# EAGLE design jam2 (EAGLE 9.6.2)
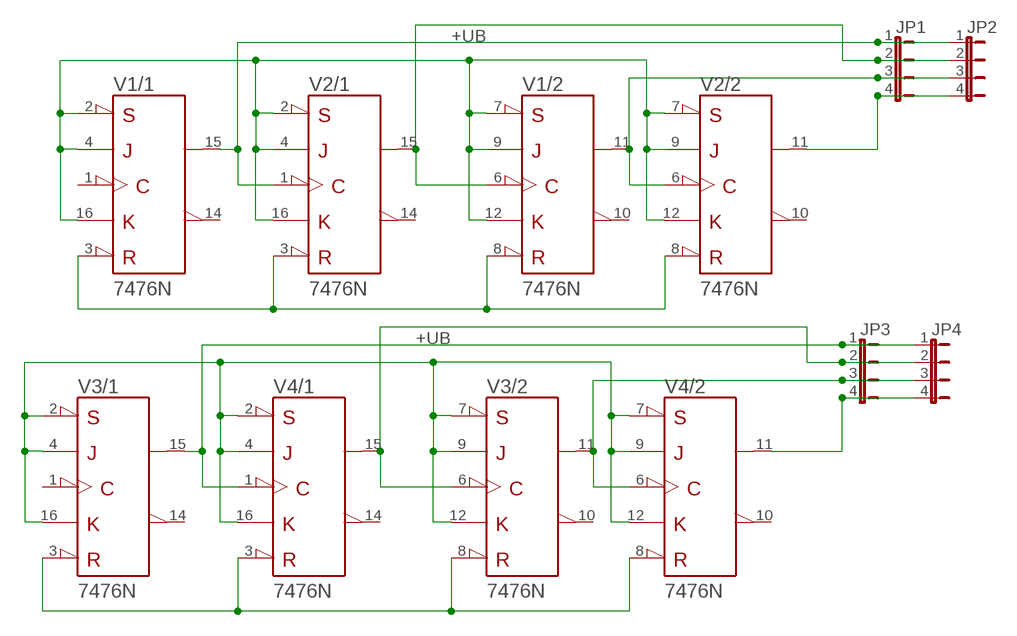
[diagram p0: schematic, sheet 1]

## Parts
JP1  JP4E  [JP4]
JP2  JP4E  [JP4]
JP3  JP4E  [JP4]
JP4  JP4E  [JP4]
V1  7476N  [DIL16]
V2  7476N  [DIL16]
V3  7476N  [DIL16]
V4  7476N  [DIL16]

## Nets
+UB: V1.2(/1:!PRE) V1.4(/1:J) V1.7(/2:!PRE) V1.9(/2:J) V1.12(/2:K) V1.16(/1:K) V2.2(/1:!PRE) V2.4(/1:J) V2.7(/2:!PRE) V2.9(/2:J) V2.12(/2:K) V2.16(/1:K) V3.2(/1:!PRE) V3.4(/1:J) V3.7(/2:!PRE) V3.9(/2:J) V3.12(/2:K) V3.16(/1:K) V4.2(/1:!PRE) V4.4(/1:J) V4.7(/2:!PRE) V4.9(/2:J) V4.12(/2:K) V4.16(/1:K)
N$1: JP1.4 JP2.4 V2.11(/2:Q)
N$2: JP1.3 JP2.3 V1.11(/2:Q) V2.6(/2:CLK)
N$3: JP1.2 JP2.2 V1.6(/2:CLK) V2.15(/1:Q)
N$4: V3.3(/1:!CLR) V3.8(/2:!CLR) V4.3(/1:!CLR) V4.8(/2:!CLR)
N$5: JP3.3 JP4.3 V3.11(/2:Q) V4.6(/2:CLK)
N$6: JP1.1 JP2.1 V1.15(/1:Q) V2.1(/1:CLK)
N$7: JP3.2 JP4.2 V3.6(/2:CLK) V4.15(/1:Q)
N$8: V1.3(/1:!CLR) V1.8(/2:!CLR) V2.3(/1:!CLR) V2.8(/2:!CLR)
N$9: JP3.4 JP4.4 V4.11(/2:Q)
N$10: JP3.1 JP4.1 V3.15(/1:Q) V4.1(/1:CLK)
Unconnected: V1.1(/1:CLK) V1.10(/2:!Q) V1.14(/1:!Q) V2.10(/2:!Q) V2.14(/1:!Q) V3.1(/1:CLK) V3.10(/2:!Q) V3.14(/1:!Q) V4.10(/2:!Q) V4.14(/1:!Q)

## Power pins joined to a net without a drawn wire
+UB: V1.5(/+UB:+UB) V2.5(/+UB:+UB) V3.5(/+UB:+UB) V4.5(/+UB:+UB)
-UB: V1.13(/-UB:-UB) V2.13(/-UB:-UB) V3.13(/-UB:-UB) V4.13(/-UB:-UB)

## Library data of the parts
JP1-JP4 = jumper:JP4E: JUMPER
V1-V4 = 74ttl-din:74*76: Dual J-K FLIP FLOP, preset and clear

## Board
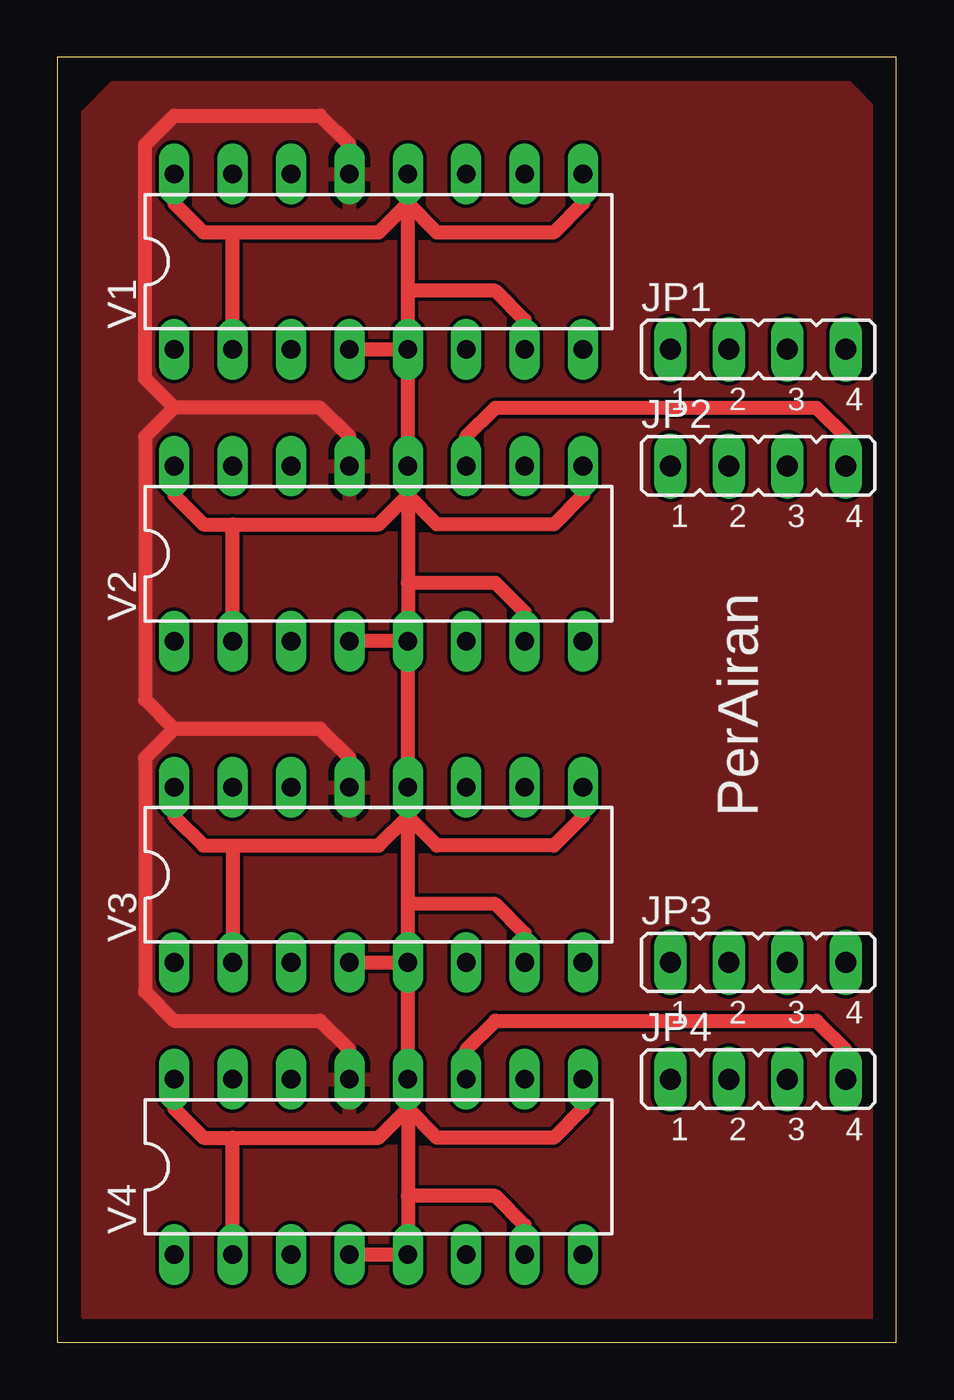
[diagram p1: board, top side]
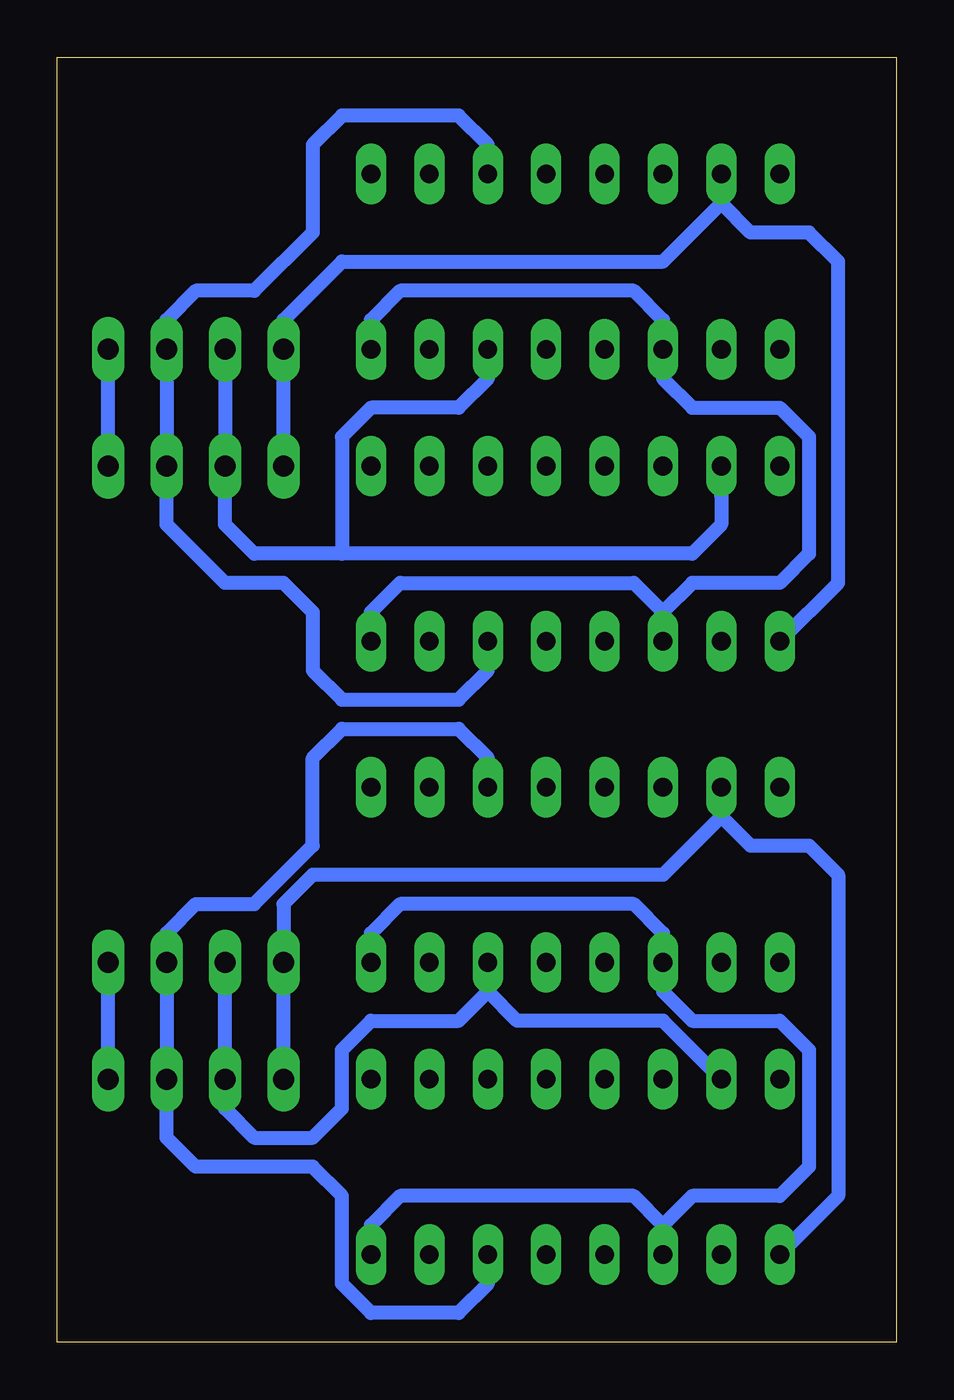
[diagram p2: board, bottom side, seen from below]

Size 36.5 x 55.87 mm. Coordinates in mm from the lower left corner, seen from the top.
Outline: 0,0 36.5,0 36.5,55.87 0,55.87 0,0
Copper layers (1*16): Top 0.035mm / dielectric 1.5mm / Bottom 0.035mm
Design rules "default": minimum track width 6mil, minimum drill 0.35mm, track to track 6mil, track to pad 6mil, pad to pad 6mil, via to via 6mil, smd to smd 6mil, copper to edge 40mil, drill to drill 6mil, minimum pad ring 10mil, minimum via ring 8mil, stop-mask expansion 4mil, vias tented up to drill 0mil, thermal gap 10mil

### Footprints (pad centres in the part's own frame; a part is rotated, then mirrored left to right if it is on the bottom)
JP4 = drill 0.914 long: 1 -3.81,0; 2 -1.27,0; 3 1.27,0; 4 3.81,0
DIL16 = drill 0.813 long: 1 -8.89,-3.81; 2 -6.35,-3.81; 3 -3.81,-3.81; 4 -1.27,-3.81; 5 1.27,-3.81; 6 3.81,-3.81; 7 6.35,-3.81; 8 8.89,-3.81; 9 8.89,3.81; 10 6.35,3.81; 11 3.81,3.81; 12 1.27,3.81; 13 -1.27,3.81; 14 -3.81,3.81; 15 -6.35,3.81; 16 -8.89,3.81

### Placement (x,y rotation side)
JP1  30.48,43.18 0 top
JP2  30.48,38.1 0 top
JP3  30.48,16.51 0 top
JP4  30.48,11.43 0 top
V1  13.97,46.99 0 top
V2  13.97,34.29 0 top
V3  13.97,20.32 0 top
V4  13.97,7.62 0 top

### Tracks (layer width: path | path; a pad name or v marks a point on that pad's centre or on a via)
+UB
  Top 0.61: V1.4 V1.5 | V1.9 22.86,49.53 21.59,48.26 16.51,48.26 15.24,49.53 | V1.12 15.24,49.53 | 15.24,49.53 13.97,48.26 7.62,48.26 | 7.62,48.26 6.35,48.26 5.08,49.53 V1.16 | V1.2 7.62,48.26 | V1.5 15.24,45.72 | 15.24,45.72 15.24,49.53 | V2.16 5.08,36.83 6.35,35.56 7.62,35.56 | 7.62,35.56 13.97,35.56 15.24,36.83 | 15.24,36.83 15.24,33.02 | 15.24,33.02 V2.5 | V2.9 22.86,36.83 21.59,35.56 16.51,35.56 15.24,36.83 | 15.24,36.83 V2.12 V1.5 | V2.2 7.62,35.56 | V2.5 V2.4 | V1.7 20.32,44.45 19.05,45.72 15.24,45.72 | V2.7 20.32,31.75 19.05,33.02 15.24,33.02 | V3.16 5.08,22.86 6.35,21.59 7.62,21.59 | 7.62,21.59 V3.2 | 7.62,21.59 13.97,21.59 15.24,22.86 | 15.24,22.86 V3.12 V2.5 | V3.5 15.24,19.05 | 15.24,19.05 15.24,22.86 | V3.9 22.86,22.86 21.59,21.59 16.51,21.59 15.24,22.86 | V3.4 V3.5 | V3.7 20.32,17.78 19.05,19.05 15.24,19.05 | V4.9 22.86,10.16 21.59,8.89 16.51,8.89 15.24,10.16 | V4.12 15.24,6.35 | 15.24,6.35 V4.5 V4.4 | V4.7 20.32,5.08 19.05,6.35 15.24,6.35 | V4.16 5.08,10.16 6.35,8.89 7.62,8.89 | 7.62,8.89 13.97,8.89 15.24,10.16 | 15.24,10.16 V4.12 | V4.2 7.62,8.89 | V4.12 V3.5
-UB
  Top 0.61: V2.13 12.7,39.37 11.43,40.64 5.08,40.64 | 5.08,40.64 3.81,41.91 3.81,52.07 5.08,53.34 11.43,53.34 12.7,52.07 V1.13 | V4.13 12.7,12.7 11.43,13.97 5.08,13.97 3.81,15.24 3.81,25.4 5.08,26.67 | V3.13 12.7,25.4 11.43,26.67 5.08,26.67 | 5.08,40.64 3.81,39.37 3.81,27.94 5.08,26.67
  pour Top: 2.54,54.61 34.29,54.61 35.56,53.34 35.56,1.27 34.29,0 2.54,0 1.27,1.27 1.27,53.34
N$1
  Top 0.61: V2.11 17.78,39.37 19.05,40.64 33.02,40.64 34.29,39.37 JP2.4
  Bottom 0.61: JP2.4 JP1.4
N$2
  Bottom 0.61: V2.6 17.78,29.21 19.05,27.94 24.13,27.94 25.4,29.21 25.4,31.75 26.67,33.02 29.21,33.02 31.75,35.56 JP2.3 JP1.3 31.75,44.45 30.48,45.72 27.94,45.72 25.4,48.26 25.4,52.07 24.13,53.34 19.05,53.34 17.78,52.07 V1.11
N$3
  Bottom 0.61: JP1.2 JP2.2 29.21,35.56 27.94,34.29 24.13,34.29 | 7.62,36.83 V2.15 7.62,35.56 8.89,34.29 24.13,34.29 | V1.6 17.78,41.91 19.05,40.64 22.86,40.64 24.13,39.37 24.13,34.29
N$4
  Bottom 0.61: V3.8 22.86,17.78 21.59,19.05 11.43,19.05 10.16,17.78 V3.3 10.16,15.24 8.89,13.97 5.08,13.97 3.81,12.7 3.81,7.62 5.08,6.35 8.89,6.35 10.16,5.08 | 10.16,5.08 11.43,6.35 21.59,6.35 22.86,5.08 V4.8 | V4.3 10.16,5.08
N$5
  Bottom 0.61: V3.11 17.78,25.4 19.05,26.67 24.13,26.67 25.4,25.4 25.4,21.59 27.94,19.05 30.48,19.05 31.75,17.78 JP3.3 JP4.3 31.75,8.89 30.48,7.62 25.4,7.62 24.13,6.35 24.13,2.54 22.86,1.27 19.05,1.27 17.78,2.54 V4.6
N$6
  Bottom 0.61: JP2.1 JP1.1 26.67,44.45 24.13,46.99 10.16,46.99 7.62,49.53 | 7.62,49.53 V1.15 | V2.1 2.54,33.02 2.54,46.99 3.81,48.26 6.35,48.26 7.62,49.53
N$7
  Bottom 0.61: JP3.2 JP4.2 29.21,10.16 27.94,8.89 25.4,8.89 24.13,10.16 24.13,12.7 22.86,13.97 19.05,13.97 17.78,15.24 | V4.15 10.16,13.97 16.51,13.97 17.78,15.24 | 17.78,15.24 V3.6
N$8
  Bottom 0.61: V1.8 22.86,44.45 21.59,45.72 11.43,45.72 10.16,44.45 V1.3 10.16,41.91 8.89,40.64 5.08,40.64 3.81,39.37 3.81,34.29 5.08,33.02 8.89,33.02 10.16,31.75 | V2.8 22.86,31.75 21.59,33.02 11.43,33.02 10.16,31.75 | 10.16,31.75 V2.3
N$9
  Top 0.61: V4.11 17.78,12.7 19.05,13.97 33.02,13.97 34.29,12.7 JP4.4
  Bottom 0.61: JP4.4 JP3.4
N$10
  Bottom 0.61: JP4.1 JP3.1 26.67,19.05 25.4,20.32 10.16,20.32 7.62,22.86 | V3.15 7.62,22.86 | 7.62,22.86 6.35,21.59 3.81,21.59 2.54,20.32 2.54,6.35 V4.1

### Text on the board
tPlace: PerAiran